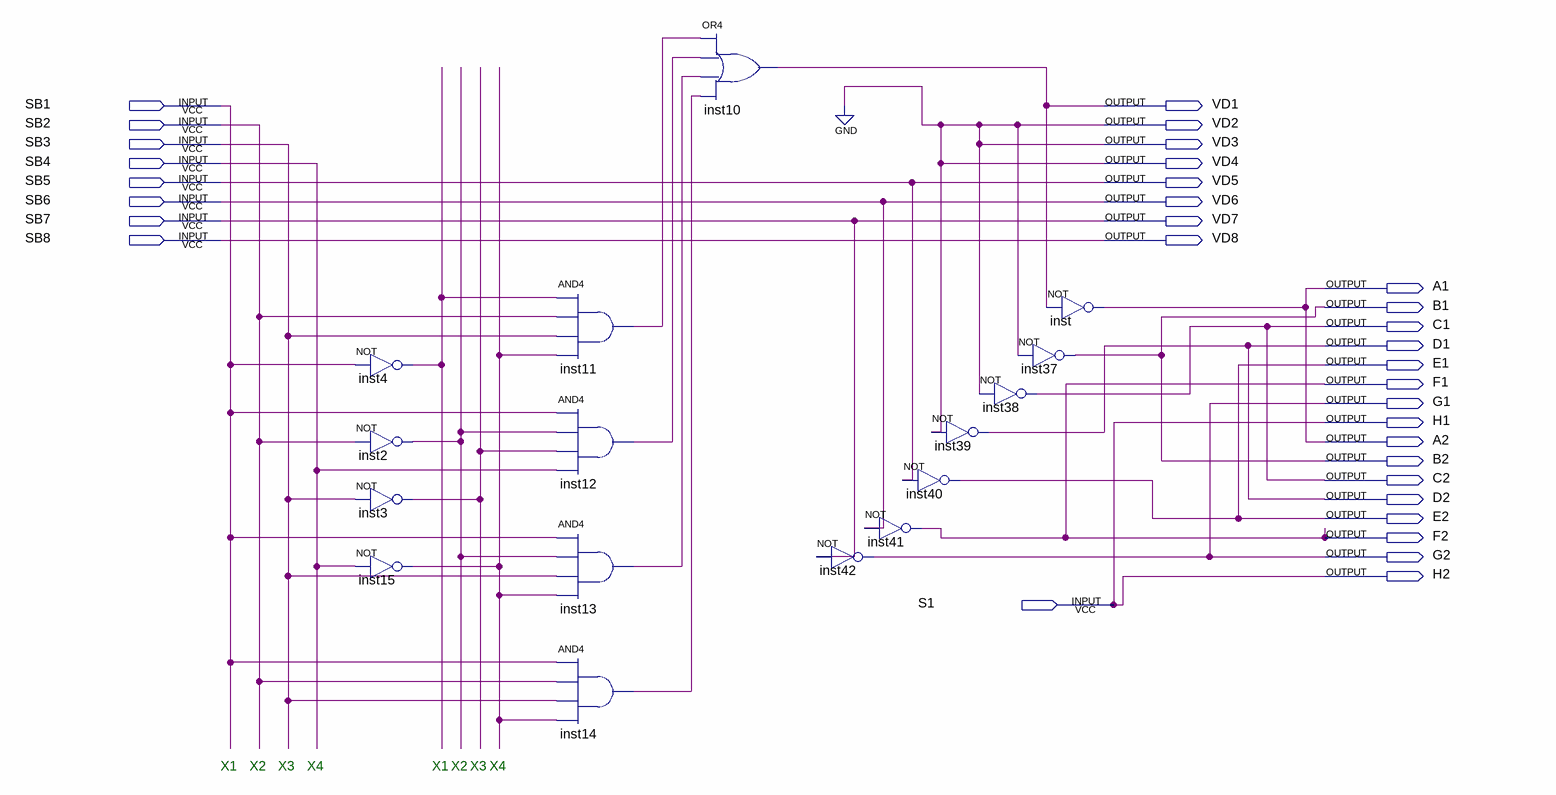
[diagram p0: schematic sheet]
// Quartus schematic lab5.bdf as structural Verilog: 16 symbols, 33 pins
module lab5 (
  input  SB1,
  input  SB2,
  input  SB3,
  input  SB4,
  input  SB5,
  input  SB6,
  input  SB7,
  input  SB8,
  input  S1,
  output VD1,
  output VD2,
  output VD3,
  output VD4,
  output VD5,
  output VD6,
  output VD7,
  output VD8,
  output A1,
  output B1,
  output C1,
  output D1,
  output E1,
  output F1,
  output G1,
  output H1,
  output A2,
  output B2,
  output C2,
  output D2,
  output E2,
  output F2,
  output G2,
  output H2
);

  wire inst2_out, inst3_out, inst4_out, inst11_out, inst12_out, inst13_out, inst14_out, inst15_out;

  not inst4 (inst4_out, SB1);
  not inst2 (inst2_out, SB2);
  not inst3 (inst3_out, SB3);
  not inst15 (inst15_out, SB4);
  and inst11 (inst11_out, inst4_out, SB2, SB3, inst15_out);
  and inst12 (inst12_out, SB1, inst2_out, inst3_out, SB4);
  and inst13 (inst13_out, SB1, inst2_out, SB3, inst15_out);
  and inst14 (inst14_out, SB1, SB2, SB3, inst15_out);
  or inst10 (VD1, inst11_out, inst12_out, inst13_out, inst14_out);
  not inst42 (G1, SB7);
  not inst40 (E1, SB5);
  not inst41 (F1, SB6);
  not inst38 (C1, 1'b0);
  not inst39 (D1, 1'b0);
  not inst (A1, VD1);
  not inst37 (B1, 1'b0);

  assign A2 = A1;
  assign B2 = B1;
  assign C2 = C1;
  assign D2 = D1;
  assign E2 = E1;
  assign F2 = F1;
  assign G2 = G1;
  assign H1 = S1;
  assign H2 = S1;
  assign VD2 = 1'b0;
  assign VD3 = 1'b0;
  assign VD4 = 1'b0;
  assign VD5 = SB5;
  assign VD6 = SB6;
  assign VD7 = SB7;
  assign VD8 = SB8;

  // Notes on the sheet:
  //   X1
  //   X2
  //   X3
  //   X4
  //   X1
  //   X2
  //   X3
  //   X4
endmodule
